# Altium schematic sheet 热控板1.SchDoc
size A3
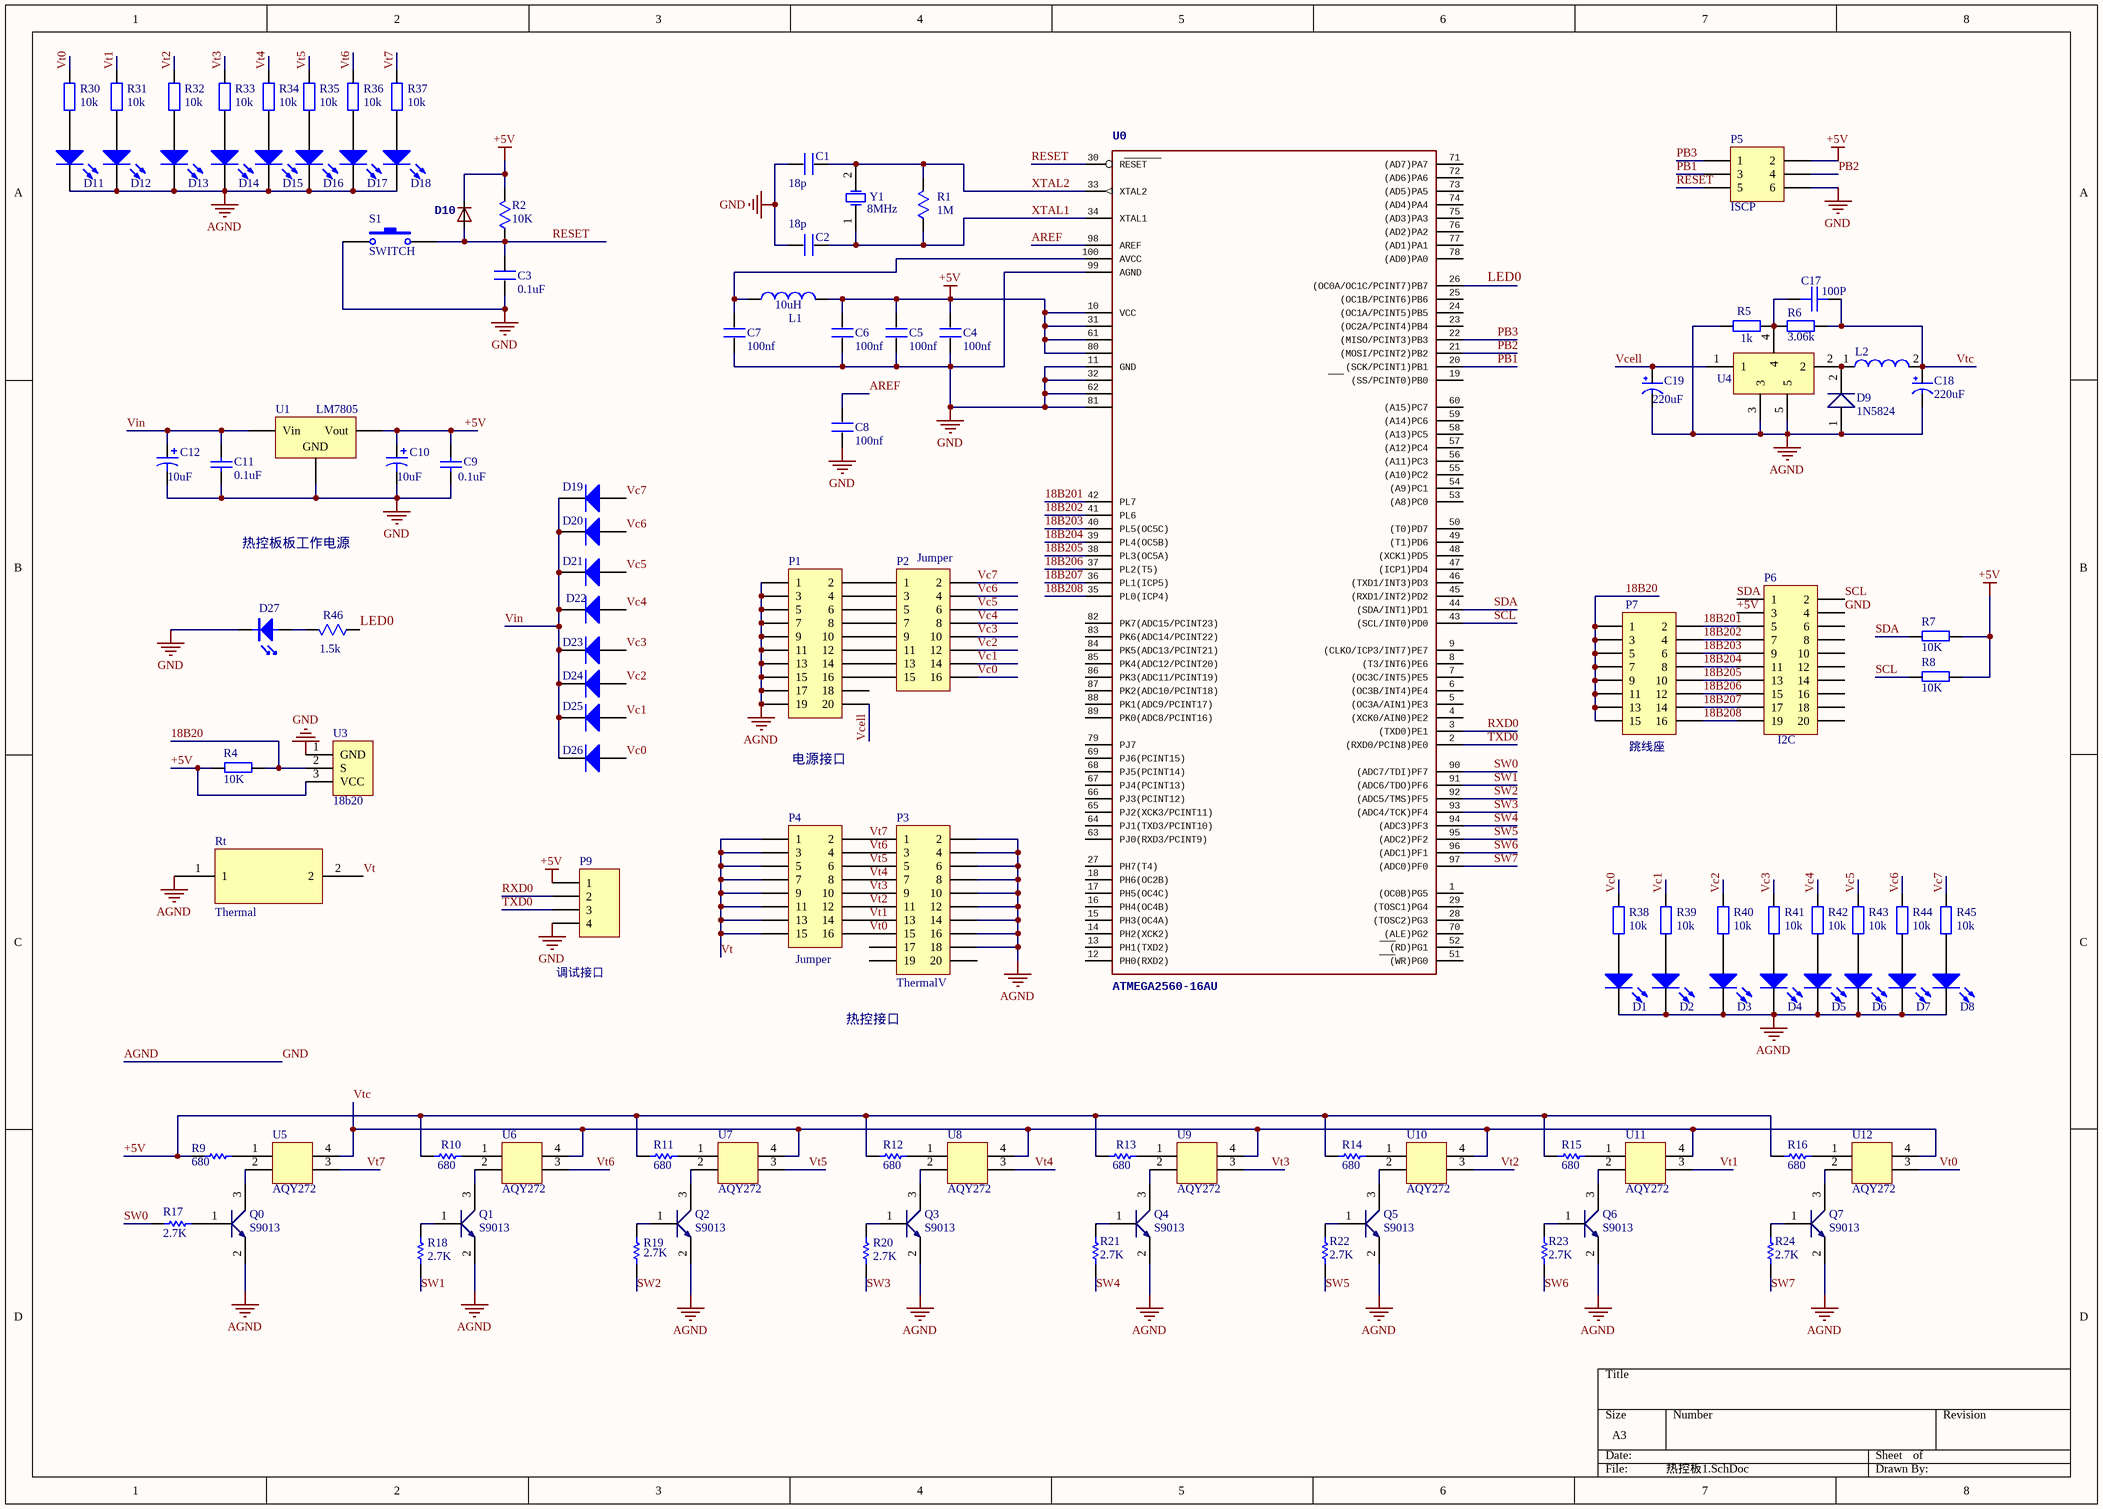
[diagram p0: 热控板1.SchDoc]

## Parts
C1  18p  [CAPC3216M]
C2  18p  [CAPC3216M]
C3  0.1uF  [RESC3216M]
C4  100nf  [CAPC3216M]
C5  100nf  [CAPC3216M]
C6  100nf  [CAPC3216M]
C7  100nf  [CAPC3216M]
C8  100nf  [CAPC3216M]
C9  0.1uf  [CAPC3216M]
C10  10uf  [25V47uF]
C11  0.1uf  [CAPC3216M]
C12  10uf  [25V47uF]
C17  100P  [CAPC3216M]
C18  220uF  [25V47uF]
C19  220uF  [25V47uF]
D1  LED  [LED]  (value not drawn)
D2  LED  [LED]  (value not drawn)
D3  LED  [LED]  (value not drawn)
D4  LED  [LED]  (value not drawn)
D5  LED  [LED]  (value not drawn)
D6  LED  [LED]  (value not drawn)
D7  LED  [LED]  (value not drawn)
D8  LED  [LED]  (value not drawn)
D9  1N5824  [DO214AC]
D10  CD1206-S01575  [MINIMELF]  (value not drawn)
D11  LED  [LED]  (value not drawn)
D12  LED  [LED]  (value not drawn)
D13  LED  [LED]  (value not drawn)
D14  LED  [LED]  (value not drawn)
D15  LED  [LED]  (value not drawn)
D16  LED  [LED]  (value not drawn)
D17  LED  [LED]  (value not drawn)
D18  LED  [LED]  (value not drawn)
D19  1N4001  [SMB]  (value not drawn)
D20  1N4001  [SMB]  (value not drawn)
D21  1N4001  [SMB]  (value not drawn)
D22  1N4001  [SMB]  (value not drawn)
D23  1N4001  [SMB]  (value not drawn)
D24  1N4001  [SMB]  (value not drawn)
D25  1N4001  [SMB]  (value not drawn)
D26  1N4001  [SMB]  (value not drawn)
D27  DS0  [LED]  (value not drawn)
L1  value 10uH  [INDC3216M]  (hidden comment: Inductor)
L2  inductance  [INDUCTANCE_1]  (value not drawn)
P1  Power Interface  [HDR2X10]  (value not drawn)
P2  Jumper  [HDR2X8]
P3  ThermalV  [HDR2X10]
P4  Jumper  [tiepianpeizhen]
P5  ISCP  [HDR2X3]
P6  I2C  [HDR2X10]
P7  跳线座  [HDR2X8]
P9  调试接口  [HDR1X4]
Q0  S9013  [SOT23]
Q1  S9013  [SOT23]
Q2  S9013  [SOT23]
Q3  S9013  [SOT23]
Q4  S9013  [SOT23]
Q5  S9013  [SOT23]
Q6  S9013  [SOT23]
Q7  S9013  [SOT23]
R1  1M  [RESC3216M]
R2  10K  [RESC3216M]
R4  10K  [RESC3216M]
R5  1k  [RESC3216M]
R6  value 3.06k  [RESC3216M]  (hidden comment: 5.1k)
R7  10K  [RESC3216M]
R8  10K  [RESC3216M]
R9  680  [RESC3216M]
R10  680  [RESC3216M]
R11  680  [RESC3216M]
R12  680  [RESC3216M]
R13  680  [RESC3216M]
R14  680  [RESC3216M]
R15  680  [RESC3216M]
R16  680  [RESC3216M]
R17  2.7K  [RESC3216M]
R18  2.7K  [RESC3216M]
R19  2.7K  [RESC3216M]
R20  2.7K  [RESC3216M]
R21  2.7K  [RESC3216M]
R22  2.7K  [RESC3216M]
R23  2.7K  [RESC3216M]
R24  2.7K  [RESC3216M]
R30  10K  [RESC3216M]
R31  10K  [RESC3216M]
R32  10K  [RESC3216M]
R33  10K  [RESC3216M]
R34  10K  [RESC3216M]
R35  10K  [RESC3216M]
R36  10K  [RESC3216M]
R37  10K  [RESC3216M]
R38  10K  [RESC3216M]
R39  10K  [RESC3216M]
R40  10K  [RESC3216M]
R41  10K  [RESC3216M]
R42  10K  [RESC3216M]
R43  10K  [RESC3216M]
R44  10K  [RESC3216M]
R45  10K  [RESC3216M]
R46  1.5k  [RESC3216m]
Rt  Thermal  [Thermal Res]
S1  SWITCH  [PUSH BUTTON 6x6]
U0  ATMEGA2560-16AU  [TQFP100]
U1  LM7805  [DPAK-3]
U3  18b20  [TO92]
U4  LM2596SADJ  [TO263_5]  (value not drawn)
U5  AQY272  [AQY272]
U6  AQY272  [AQY272]
U7  AQY272  [AQY272]
U8  AQY272  [AQY272]
U9  AQY272  [AQY272]
U10  AQY272  [AQY272]
U11  AQY272  [AQY272]
U12  AQY272  [AQY272]
Y1  8MHz  [XTAL_US]

## Nets
+5V: C4.2 C5.2 C6.2 C9.2 C10.1 D10.C L1.2 P5.2 P6.3 P9.1 R2.2 R4.2 R7.1 R8.1 R9.1 R10.1 R11.1 R12.1 R13.1 R14.1 R15.1 R16.1 U0.10(VCC) U0.31(VCC1) U0.61(VCC2) U0.80(VCC3) U1.3(Vout) U3.3(VCC)
AGND: C1.1 C2.1 C3.1 C4.1 C5.1 C6.1 C7.1 C8.1 C9.1 C10.2 C11.1 C12.2 C18.2(GND) C19.2(GND) D1.2(K) D2.2(K) D3.2(K) D4.2(K) D5.2(K) D6.2(K) D7.2(K) D8.2(K) D9.1 D11.2(K) D12.2(K) D13.2(K) D14.2(K) D15.2(K) D16.2(K) D17.2(K) D18.2(K) D27.2 P1.1 P1.3 P1.5 P1.7 P1.9 P1.11 P1.13 P1.15 P1.17 P1.19 P3.2 P3.4 P3.6 P3.8 P3.10 P3.12 P3.14 P3.16 P3.18 P5.6 P6.4 P9.4 Q0.2 Q1.2 Q2.2 Q3.2 Q4.2 Q5.2 Q6.2 Q7.2 R5.2 Rt.1 S1.1 U0.11(GND) U0.32(GND1) U0.62(GND2) U0.81(GND3) U0.99(AGND) U1.2(GND) U3.1(GND) U4.3 U4.5  [also labelled GND]
18B20: P7.1 P7.3 P7.5 P7.7 P7.9 P7.11 P7.13 P7.15 R4.1 U3.2(S)
18B201: P6.5 P7.2 U0.42(PL7)
18B202: P6.7 P7.4 U0.41(PL6)
18B203: P6.9 P7.6 U0.40(PL5(OC5C))
18B204: P6.11 P7.8 U0.39(PL4(OC5B))
18B205: P6.13 P7.10 U0.38(PL3(OC5A))
18B206: P6.15 P7.12 U0.37(PL2(T5))
18B207: P6.17 P7.14 U0.36(PL1(ICP5))
18B208: P6.19 P7.16 U0.35(PL0(ICP4))
AREF: C8.2 U0.98(AREF)
LED0: R46.1 U0.26((OC0A/OC1C/PCINT7)PB7)
PB1: P5.3 U0.20((SCK/PCINT1)PB1)
PB2: P5.4 U0.21((MOSI/PCINT2)PB2)
PB3: P5.1 U0.22((MISO/PCINT3)PB3)
RESET: C3.2 D10.A P5.5 R2.1 S1.2 U0.30(RESET)
RXD0: P9.2 U0.3((TXD0)PE1)
SCL: P6.2 R8.2 U0.43((SCL/INT0)PD0)
SDA: P6.1 R7.2 U0.44((SDA/INT1)PD1)
SW0: R17.1 U0.90((ADC7/TDI)PF7)
SW1: R18.1 U0.91((ADC6/TDO)PF6)
SW2: R19.1 U0.92((ADC5/TMS)PF5)
SW3: R20.1 U0.93((ADC4/TCK)PF4)
SW4: R21.1 U0.94((ADC3)PF3)
SW5: R22.1 U0.95((ADC2)PF2)
SW6: R23.1 U0.96((ADC1)PF1)
SW7: R24.1 U0.97((ADC0)PF0)
TXD0: P9.3 U0.2((RXD0/PCIN8)PE0)
Vc0: D26.1(A) P2.16 R38.2
Vc1: D25.1(A) P2.14 R39.2
Vc2: D24.1(A) P2.12 R40.2
Vc3: D23.1(A) P2.10 R41.2
Vc4: D22.1(A) P2.8 R42.2
Vc5: D21.1(A) P2.6 R43.2
Vc6: D20.1(A) P2.4 R44.2
Vc7: D19.1(A) P2.2 R45.2
Vcell: C19.1(VCC) P1.20 U4.1
Vin: C11.2 C12.1 D19.2(K) D20.2(K) D21.2(K) D22.2(K) D23.2(K) D24.2(K) D25.2(K) D26.2(K) U1.1(Vin)
Vt: P4.1 P4.3 P4.5 P4.7 P4.9 P4.11 P4.13 P4.15 Rt.2
Vt0: P3.15 P4.16 R30.2 U12.3
Vt1: P3.13 P4.14 R31.2 U11.3
Vt2: P3.11 P4.12 R32.2 U10.3
Vt3: P3.9 P4.10 R33.2 U9.3
Vt4: P3.7 P4.8 R34.2 U8.3
Vt5: P3.5 P4.6 R35.2 U7.3
Vt6: P3.3 P4.4 R36.2 U6.3
Vt7: P3.1 P4.2 R37.2 U5.3
Vtc: C17.2 C18.1(VCC) L2.2 R6.1 U5.4 U6.4 U7.4 U8.4 U9.4 U10.4 U11.4 U12.4
XTAL1: C2.2 R1.1 U0.34(XTAL1) Y1.1(OSC1)
XTAL2: C1.2 R1.2 U0.33(XTAL2) Y1.2(OSC2)
NetC7_2: C7.2 L1.1 U0.100(AVCC)
NetC17_1: C17.1 R5.1 R6.2 U4.4
NetD1_1: D1.1(A) R38.1
NetD2_1: D2.1(A) R39.1
NetD3_1: D3.1(A) R40.1
NetD4_1: D4.1(A) R41.1
NetD5_1: D5.1(A) R42.1
NetD6_1: D6.1(A) R43.1
NetD7_1: D7.1(A) R44.1
NetD8_1: D8.1(A) R45.1
NetD9_2: D9.2 L2.1 U4.2
NetD11_1: D11.1(A) R30.1
NetD12_1: D12.1(A) R31.1
NetD13_1: D13.1(A) R32.1
NetD14_1: D14.1(A) R33.1
NetD15_1: D15.1(A) R34.1
NetD16_1: D16.1(A) R35.1
NetD17_1: D17.1(A) R36.1
NetD18_1: D18.1(A) R37.1
NetD27_1: D27.1 R46.2
NetP1_2: P1.2 P2.1
NetP1_4: P1.4 P2.3
NetP1_6: P1.6 P2.5
NetP1_8: P1.8 P2.7
NetP1_10: P1.10 P2.9
NetP1_12: P1.12 P2.11
NetP1_14: P1.14 P2.13
NetP1_16: P1.16 P2.15
NetQ0_1: Q0.1 R17.2
NetQ0_3: Q0.3 U5.2
NetQ1_1: Q1.1 R18.2
NetQ1_3: Q1.3 U6.2
NetQ2_1: Q2.1 R19.2
NetQ2_3: Q2.3 U7.2
NetQ3_1: Q3.1 R20.2
NetQ3_3: Q3.3 U8.2
NetQ4_1: Q4.1 R21.2
NetQ4_3: Q4.3 U9.2
NetQ5_1: Q5.1 R22.2
NetQ5_3: Q5.3 U10.2
NetQ6_1: Q6.1 R23.2
NetQ6_3: Q6.3 U11.2
NetQ7_1: Q7.1 R24.2
NetQ7_3: Q7.3 U12.2
NetR9_2: R9.2 U5.1
NetR10_2: R10.2 U6.1
NetR11_2: R11.2 U7.1
NetR12_2: R12.2 U8.1
NetR13_2: R13.2 U9.1
NetR14_2: R14.2 U10.1
NetR15_2: R15.2 U11.1
NetR16_2: R16.2 U12.1

Not connected (* = marked no-connect by the designer): P1 18; P3 17 19 20; P6 6 8 10 12 14 16 18 20; U0 1((OC0B)PG5) 4((XCK0/AIN0)PE2) 5((OC3A/AIN1)PE3) 6((OC3B/INT4)PE4) 7((OC3C/INT5)PE5) 8((T3/INT6)PE6) 9((CLKO/ICP3/INT7)PE7) 12(PH0(RXD2)) 13(PH1(TXD2)) 14(PH2(XCK2)) 15(PH3(OC4A)) 16(PH4(OC4B)) 17(PH5(OC4C)) 18(PH6(OC2B)) 19((SS/PCINT0)PB0) 23((OC2A/PCINT4)PB4) 24((OC1A/PCINT5)PB5) 25((OC1B/PCINT6)PB6) 27(PH7(T4)) 28((TOSC2)PG3) 29((TOSC1)PG4) 45((RXD1/INT2)PD2) 46((TXD1/INT3)PD3) 47((ICP1)PD4) 48((XCK1)PD5) 49((T1)PD6) 50((T0)PD7) 51((WR)PG0) 52((RD)PG1) 53((A8)PC0) 54((A9)PC1) 55((A10)PC2) 56((A11)PC3) 57((A12)PC4) 58((A13)PC5) 59((A14)PC6) 60((A15)PC7) 63(PJ0(RXD3/PCINT9)) 64(PJ1(TXD3/PCINT10)) 65(PJ2(XCK3/PCINT11)) 66(PJ3(PCINT12)) 67(PJ4(PCINT13)) 68(PJ5(PCINT14)) 69(PJ6(PCINT15)) 70((ALE)PG2) 71((AD7)PA7) 72((AD6)PA6) 73((AD5)PA5) 74((AD4)PA4) 75((AD3)PA3) 76((AD2)PA2) 77((AD1)PA1) 78((AD0)PA0) 79(PJ7) 82(PK7(ADC15/PCINT23)) 83(PK6(ADC14/PCINT22)) 84(PK5(ADC13/PCINT21)) 85(PK4(ADC12/PCINT20)) 86(PK3(ADC11/PCINT19)) 87(PK2(ADC10/PCINT18)) 88(PK1(ADC9/PCINT17)) 89(PK0(ADC8/PCINT16))

## Notes on the sheet
- 热控板板工作电源
- 电源接口
- 热控接口

## Library data of the parts
C1 C2 = C_1
C3 = C_3
C4-C8 = C
C9 = Cap Semi: Published: 8-Jun-2000; LatestRevisionDate: 17-Jul-2002; LatestRevisionNote: Re-released for DXP Platform.; PackageReference: C1206; Publisher: Altium Limited; Value: 0.1uF
C10 C12 = Cap Pol3: Published: 8-Jun-2000; LatestRevisionDate: 17-Jul-2002; LatestRevisionNote: Re-released for DXP Platform.; PackageReference: C0805; Publisher: Altium Limited; Value: 10uF
C11 = Cap: Published: 8-Jun-2000; LatestRevisionDate: 17-Jul-2002; LatestRevisionNote: Re-released for DXP Platform.; Publisher: Altium Limited; Value: 0.1uF
C17-C19 = CAP
D1-D8 D11-D18 = LED2: Typical RED, GREEN, YELLOW, AMBER GaAs LED; Published: 8-Jun-2000; LatestRevisionDate: 17-Jul-2002; LatestRevisionNote: Re-released for DXP Platform.; PackageDocument: Feb-2002; PackageReference: 3.2X1.6X1.1; Publisher: Altium Limited
D10 = DIODE-MINIMELF: <b>DIODE</b>
D19-D26 = Diode 1N4001: 1 Amp General Purpose Rectifier; Published: 8-Jun-2000; LatestRevisionDate: 17-Jul-2002; LatestRevisionNote: Re-released for DXP Platform.; DatasheetVersion: 1998; PackageVersion: Aug-1999; PackageReference: DO-41; Publisher: Altium Limited; PackageDescription: Diode, Axial; Body 5.2 x 2.7 mm (LxDia. max), Lead Dia. 0.86 mm (max); Code_JEDEC: DO-204-AL; ComponentLink1Description: Manufacturer Link; ComponentLink1URL: http://www.fairchildsemi.com/; ComponentLink2Description: Datasheet; ComponentLink2URL: http://www.fairchildsemi.com/ds/1N%2F1N4001.pdf
D27 = LED
L1 = Inductor: Code_IEC: 1005; Published: 8-Jun-2000; LatestRevisionDate: 29-May-2009; LatestRevisionNote: IPC-7351 Footprint Added.; PackageReference: 0402-A; Publisher: Altium Limited; PackageDescription: Chip Inductor; Code_JEITA: 0402
P1 P3 P6 = Header 10X2: Header, 10-Pin, Dual row; LatestRevisionDate: 17-Jul-2002; LatestRevisionNote: Re-released for DXP Platform.; Publisher: Altium Limited
P2 P4 P7 = Header 8X2: Header, 8-Pin, Dual row; LatestRevisionDate: 17-Jul-2002; LatestRevisionNote: Re-released for DXP Platform.; Publisher: Altium Limited
P5 = Header 3X2: Header, 3-Pin, Dual row; LatestRevisionDate: 17-Jul-2002; LatestRevisionNote: Re-released for DXP Platform.; Publisher: Altium Limited
P9 = Header 4: Header, 4-Pin; LatestRevisionDate: 17-Jul-2002; LatestRevisionNote: Re-released for DXP Platform.; Publisher: Altium Limited
R1 R2 R46 = RES
R4 R7 R8 = R
R5 R6 = Res2: Resistor; Published: 8-Jun-2000; LatestRevisionDate: 17-Jul-2002; LatestRevisionNote: Re-released for DXP Platform.; PackageReference: AXIAL-0.4; Publisher: Altium Limited
  R5: Value: 1k
R9-R24 = Res: resistance
R30-R45 = Res2: 5.1k; Published: 8-Jun-2000; LatestRevisionDate: 17-Jul-2002; LatestRevisionNote: Re-released for DXP Platform.; PackageReference: AXIAL-0.4; Publisher: Altium Limited; Value: 10k
Rt = jrdz
U0 = ATMEGA2560AU: <b>MICROCONTROLLER</b><p> / 64/128/256 Kbytes FLASH<p> / 4 Kbytes EEPROM<p> / 8 Kbytes SRAM<p> / 86 General Purpose I/O pins<p> / 12-channels16-bit PWM<p> / 4 x Serial USARTs<p> / 16-channels 10-bit A/D<p>
U1 = Volt Reg: Voltage Regulator; Published: 24-Mar-1999; LatestRevisionDate: 29-May-2009; LatestRevisionNote: IPC-7351 Footprint Added.; PackageReference: D2PAK; Publisher: Altium Limited; PackageDescription: 3-Pin Transistor Outline Package 2.54 mm Pitch, 15.1 mm Lead Span
Y1 = XTAL: Crystal Oscillator; Published: 8-Jun-2000; LatestRevisionDate: 17-Jul-2002; LatestRevisionNote: Re-released for DXP Platform.; Publisher: Altium Limited